# EAGLE design NinjaPCR-131202 (EAGLE 6.3)
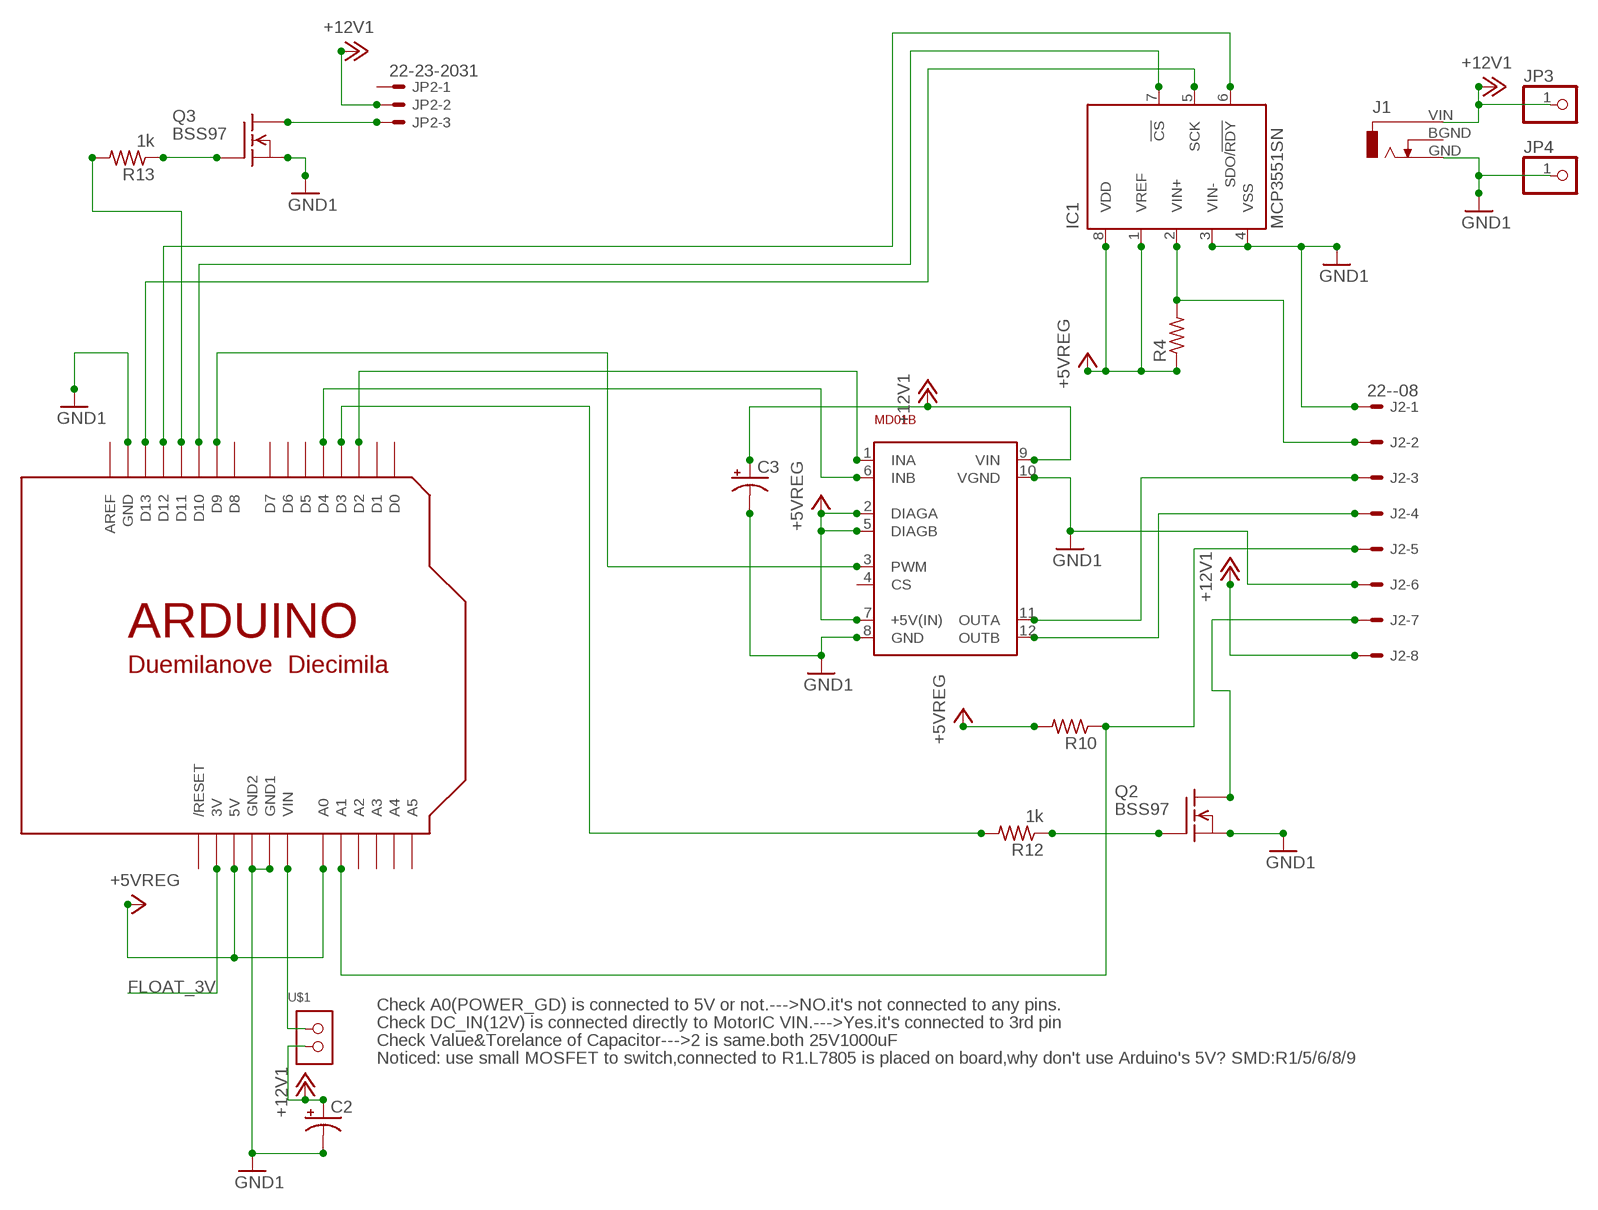
[diagram p0: schematic, sheet 1]

## Parts
C2  CPOL-USE5-8.5  [E5-8,5]
C3  CPOL-USE5-13  [E5-13]
IC1  MCP3551SN  [SO-08]
J1  DCJ0303  [DCJ0303]
J2  22--08  [POLOLU-8-VERTICAL]
JP2  22-23-2031  [22-23-2031]
JP3  PINHD-1X1  [1X01]
JP4  PINHD-1X1  [1X01]
MD01B  VNH3SP30+4PINN  [VNH3SP30+4PIN_NOHOLES]
Q2  BSS97  [TO202]
Q3  BSS97  [TO202]
R4  R-US_0207/10  [0207/10]
R10  R-US_0207/10  [0207/10]
R12  1k  R-US_0207/10  [0207/10]
R13  1k  R-US_0207/10  [0207/10]
U$1  1X02  [1X02_1.1_UNSIGNED]
U$3  ARDUINODUEMILANOVE  [ARDUINO]

## Nets
+5VREG [2A]: IC1.1(VREF) IC1.8(VDD) MD01B.2(DIAGA) MD01B.5(DIAGB) MD01B.7(+5V(IN)) R4.1 R10.2 U$3.5V U$3.A0
+12V1 [8A]: C2.+ C3.+ J1.VIN J2.8 JP2.2 JP3.1 MD01B.9(VIN) U$1.2
D13: IC1.5(SCK) U$3.D13
FLOAT_3V: U$3.3V
GND1 [2A]: C2.- C3.- IC1.3(VIN-) IC1.4(VSS) J1.GND J2.1 J2.6 JP4.1 MD01B.8(GND) MD01B.10(VGND) Q2.1(S) Q3.1(S) U$3.GND U$3.GND1 U$3.GND2
N$1: JP2.3 Q3.2(D)
N$2: Q3.3(G) R13.1
N$3: R13.2 U$3.D11
N$5: U$1.1 U$3.VIN
N$8: R12.2 U$3.D3
N$9: J2.3 MD01B.11(OUTA)
N$10: J2.4 MD01B.12(OUTB)
N$18 [3A]: J2.7 Q2.2(D)
N$23: IC1.2(VIN+) J2.2 R4.2
N$27: IC1.6(SDO/!RDY) U$3.D12
N$29: IC1.7(!CS) U$3.D10
N$37: J2.5 R10.1 U$3.A1
S$1: MD01B.1(INA) U$3.D2
S$2: MD01B.3(PWM) U$3.D9
S$3: MD01B.6(INB) U$3.D4
T1: Q2.3(G) R12.1
Unconnected: J1.BGND JP2.1 MD01B.4(CS) U$3.A2 U$3.A3 U$3.A4 U$3.A5 U$3.AREF U$3.D0 U$3.D1 U$3.D5 U$3.D6 U$3.D7 U$3.D8 U$3.RESET(/RESET)

## Notes on the sheet
- Check A0(POWER_GD) is connected to 5V or not.--->NO.it's not connected to any pins.
- Check DC_IN(12V) is connected directly to MotorIC VIN.--->Yes.it's connected to 3rd pin
- Check Value&Torelance of Capacitor--->2 is same.both 25V1000uF
- Noticed: use small MOSFET to switch,connected to R1.L7805 is placed on board,why don't use Arduino's 5V? SMD:R1/5/6/8/9

## Library data of the parts
C2 C3 = rcl:CPOL-US: POLARIZED CAPACITOR, American symbol
IC1 = microchip:MCP355*: Low-Power, Single-Channel 22-Bit Delta-Sigma ADCs Source: http://ww1.microchip.com/downloads/en/DeviceDoc/21950c.pdf; MPN: MCP3551-E/SN; OC_FARNELL: 1084625; OC_NEWARK: 97K4494
J1 = JACK:DCJ0303: DC POWER JACK Source: DCJ0303.pdf; OC_FARNELL: unknown; OC_NEWARK: unknown
J2 = con-molex:22-?-08: CONNECTOR wire to board 2.54 mm (.1 inch) pitch header
JP2 = con-molex:22-23-2031: .100" (2.54mm) Center Header - 3 Pin; MF: MOLEX; MPN: 22-23-2031; OC_FARNELL: 1462950; OC_NEWARK: 30C0862
JP3 JP4 = pinhead:PINHD-1X1: PIN HEADER
MD01B = MOTORDRIVE:VNH3SP30+4PIN
Q2 Q3 = openpcr:BSS97: N-Channel Enhancement MOSFET 200V; 1.5A; 1,6Ohm
R4 R10 R12 R13 = resistor:R-US_: RESISTOR, American symbol
U$1 = PIN:1X02
U$3 = openpcr:ARDUINO: Arduino Diecimila/Duemilanove Make a shield with ease, this package has all the named pins as well as the two mounting drill holes and an outline of the USB and DC power connector. The outline is on the DIMENSION layer, so if your board house uses it they will cut the outline to match. http://www.ladyada.net/library/pcb/eaglelibrary.html

## Net classes
0 default: width 0.381 mm
1 2A: width 0.406 mm
2 8A: width 2.54 mm
3 3A: width 1.016 mm

## Board
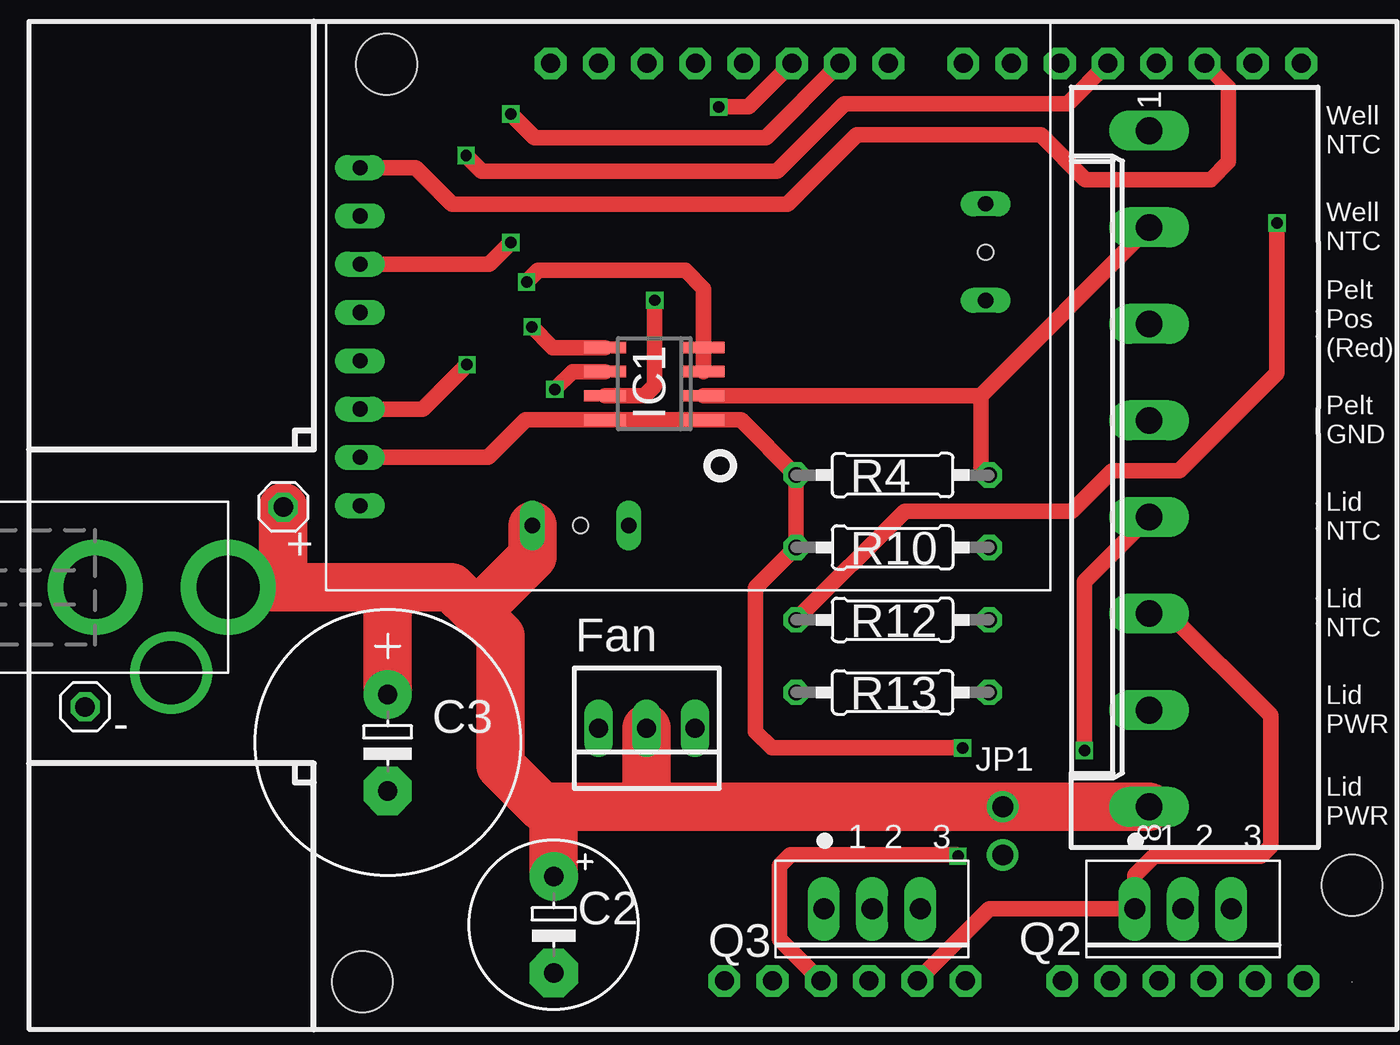
[diagram p1: board, top side]
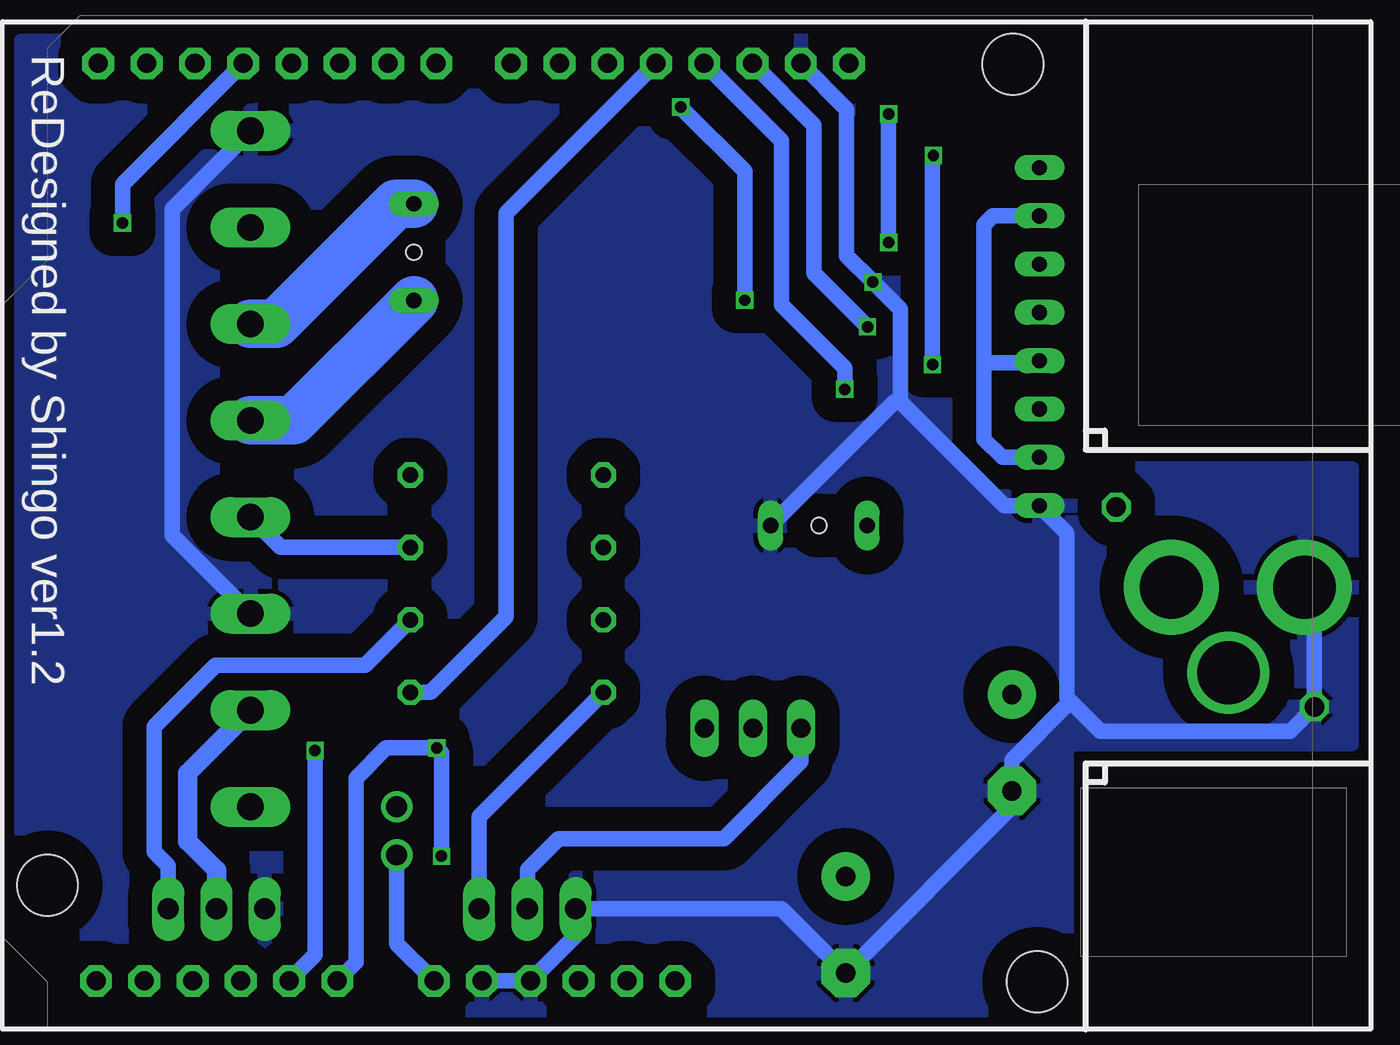
[diagram p2: board, bottom side, seen from below]

No outline drawn. Coordinates in mm, seen from the top.
Copper layers (1*16): Top 0.035mm / dielectric 1.5mm / Bottom 0.035mm
Design rules "Fusion_eagle_rule_v1.1": minimum track width 6mil, minimum drill 12mil, track to track 6mil, track to pad 6mil, pad to pad 6mil, via to via 6mil, smd to smd 0mil, copper to edge 10mil, drill to drill 10mil, minimum pad ring 10mil, minimum via ring 6mil, stop-mask expansion 2mil, vias tented up to drill 100mil, thermal gap 10mil

### Footprints (pad centres in the part's own frame; a part is rotated, then mirrored left to right if it is on the bottom)
E5-8,5 = drill 1.016 pad 2.54: + -2.54,0 | drill 1.016 pad 2.54 octagon: - 2.54,0
E5-13 = drill 1.016 pad 2.54: + -2.54,0 | drill 1.016 pad 2.54 octagon: - 2.54,0
SO-08 = smd 0.6 x 2.2: 1 -1.905,-2.6; 2 -0.635,-2.6; 3 0.635,-2.6; 4 1.905,-2.6; 5 1.905,2.6; 6 0.635,2.6; 7 -0.635,2.6; 8 -1.905,2.6
DCJ0303 = drill 3.3 pad 4: BGND 4.5,-3 | drill 3.3 pad 5: GND 0,-7; VIN 0,0
POLOLU-8-VERTICAL = drill 1.4 long: 1 17.78,0; 2 12.7,0; 3 7.62,0; 4 2.54,0; 5 -2.54,0; 6 -7.62,0; 7 -12.7,0; 8 -17.78,0
22-23-2031 = drill 1 long: 1 -2.54,0; 2 0,0; 3 2.54,0
1X01 = drill 1.016 octagon: 1 0,0
VNH3SP30+4PIN_NOHOLES = drill 0.8 long: 1 1.778,22.225; 2 1.778,19.685; 3 1.778,17.145; 4 1.778,14.605; 5 1.778,12.065; 6 1.778,9.525; 7 1.778,6.985; 8 1.778,4.445; 9 10.846,3.4; 10 15.926,3.4; 11 34.7,20.32; 12 34.7,15.24 | hole 0.8: 34.7,17.78; 13.386,3.4
TO202 = drill 1.118 long: 1 -2.54,-5.08; 2 0,-5.08; 3 2.54,-5.08
0207/10 = drill 0.813 octagon: 1 -5.08,0; 2 5.08,0
1X02_1.1_UNSIGNED = drill 1.1: 1 -2.54,0; 2 0,0
ARDUINO-NOSILK = drill 1 pad 1.676 octagon: 3V 36.068,2.54; 5V 38.608,2.54; A0 51.308,2.54; A1 53.848,2.54; A2 56.388,2.54; A3 58.928,2.54; A4 61.468,2.54; A5 64.008,2.54; AREF 24.384,50.8; D0 63.881,50.8; D1 61.341,50.8; D2 58.801,50.8; D3 56.261,50.8; D4 53.721,50.8; D5 51.181,50.8; D6 48.641,50.8; D7 46.101,50.8; D8 42.164,50.8; D9 39.624,50.8; D10 37.084,50.8; D11 34.544,50.8; D12 32.004,50.8; D13 29.464,50.8; GND 26.924,50.8; GND1 43.688,2.54; GND2 41.148,2.54; RESET 33.528,2.54; VIN 46.228,2.54 | hole 3.2: 15.758,50.754; 66.558,7.574; 14.488,2.494

### Placement (x,y rotation side)
C2  27.62,5.5 270 top
C3  18.88,15.07 270 top
IC1  32.92,33.95 90 top
J1  10.49,23.25 270 top
J2  58.95,29.48 90 top
JP2  32.52,15.83 180 top
JP3  13.4,27.46 270 top
JP4  2.96,16.95 270 top
MD01B  15.65,23.1 0 top
Q2  60.74,11.41 0 top
Q3  44.38,11.41 0 top
R4  45.45,29.15 0 top
R10  45.45,25.34 180 top
R12  45.45,21.53 180 top
R13  45.45,17.72 0 top
U$1  51.25,11.7 90 top
U$3  ARDUINODUEMILANOVE  [ARDUINO-NOSILK]  3.07,0 0 top

### Tracks (layer width: path | path; a pad name or v marks a point on that pad's centre or on a via)
+5VREG  (via drill 0.6)
  Top 0.813: v48.9,9.11 48.84,9.17 40.07,9.17 39.5,8.59 39.5,4.72 U$3.5V | v49.14,14.79 39.11,14.79 38.25,15.65 38.25,23.22 R10.2 R4.1 37.48,32.05 IC1.1 IC1.8 26.15,32.05 24.18,30.08 MD01B.7
  Bottom 0.813: U$3.A0 53.39,3.53 53.39,13.21 51.81,14.79 v49.14,14.79 48.9,14.55 v48.9,9.11 | MD01B.2 19.88,42.78 20.36,42.31 20.36,35.04 | 20.36,35.04 20.36,31.05 19.39,30.08 MD01B.7 | MD01B.5 17.55,35.04 20.36,35.04
+12V1
  Top 2.54: J1.VIN 13.01,23.25 | JP3.1 13.4,23.63 13.01,23.25 | 27.62,11.7 26.97,11.7 24.82,13.86 24.82,20.66 23.55,21.92 | 27.62,11.7 32.52,11.7 | 32.52,11.7 U$1.2 52.27,11.7 J2.8 | 23.55,21.92 22.23,23.25 18.89,23.25 | 18.89,23.25 13.01,23.25 | C2.+ 27.62,11.7 | JP2.2 32.52,11.7 | MD01B.9 26.5,24.87 23.55,21.92 | C3.+ 18.89,23.25
D13  (via drill 0.6)
  Top 0.813: IC1.5 27.57,35.86 v26.48,36.95
  Bottom 0.813: v26.48,36.95 29.3,39.77 29.3,47.56 U$3.D13
GND1  (via drill 0.6)
  Top 0.813: U$3.GND1 50.55,6.33 Q2.1 58.2,8.1 59.2,9.11 64.84,9.11 65.35,9.62 65.35,16.51 60,21.86 J2.6 | IC1.3 IC1.4 35.52,38.95 34.55,39.92 26.81,39.92 v26.2,39.31
  Bottom 0.813: J1.GND 2.96,22.72 JP4.1 4.24,15.67 14.23,15.67 15.8,17.25 | 15.8,17.25 15.98,17.43 15.98,26.09 MD01B.8 19.29,27.54 24.75,33.01 | C3.- 18.89,14.16 15.8,17.25 | 18.89,12.69 C3.- | U$3.GND1 U$3.GND2 41.84,4.92 Q3.1 31,6.33 C2.- 18.89,11.69 C3.- | U$3.GND 27.59,48.39 27.59,40.69 v26.2,39.31 24.75,37.86 24.75,33.01 | MD01B.10 25.06,33.01 24.75,33.01 | J2.1 63.08,43.13 63.08,25.99 J2.6 | 19.05,12.53 C3.-
  pour Bottom (isolate 1.27): 16,52 71,52 71,1 16,1 16,15 1,15 1,29.5 16,29.5
N$1
  Bottom 0.813: Q3.2 44.38,8.39 42.75,10.03 34.04,10.03 29.98,14.09 JP2.3
N$2
  Bottom 0.813: R13.1 46.92,11.18 Q3.3
N$3
  Bottom 0.813: R13.2 49.46,17.72 45.49,21.69 45.49,42.92 U$3.D11
N$5
  Bottom 0.813: U$3.VIN 51.25,4.49 U$1.1
N$8  (via drill 0.6)
  Top 0.813: R12.2 46.09,27.25 54.88,27.25 57.01,29.38 60.55,29.38 65.68,34.51 v65.68,42.41
  Bottom 0.813: v65.68,42.41 65.68,44.45 U$3.D3
N$9
  Bottom 2.54: J2.3 57.59,37.1 51.28,43.41 MD01B.11
N$10
  Bottom 2.54: J2.4 56.67,32.02 MD01B.12
N$18
  Bottom 1.016: Q2.2 60.74,8.37 62.26,9.89 62.26,13.47 J2.7
N$23
  Top 0.813: 50.09,33.32 IC1.2 | J2.2 50.09,33.32 | R4.2 50.09,29.6 50.09,33.32
N$27  (via drill 0.6)
  Top 0.813: v27.68,33.66 28.61,34.59 IC1.6
  Bottom 0.813: U$3.D12 31.01,46.73 31.01,38.11 27.68,34.78 v27.68,33.66
N$29  (via drill 0.6)
  Top 0.813: v32.94,38.35 32.94,33.84 32.41,33.31 32.4,33.32 IC1.7 | v36.31,48.51 37.87,48.51 U$3.D10
  Bottom 0.813: v32.94,38.35 32.94,45.13 v36.31,48.5 v36.31,48.51
N$37  (via drill 0.6)
  Top 0.813: v55.55,14.66 55.55,23.54 J2.5
  Bottom 0.813: R10.1 57.35,25.34 J2.5 | U$3.A1 55.55,3.91 v55.55,14.66
S$1
  Top 0.813: U$3.D2 63.12,49.55 63.12,45.62 62.19,44.69 55.61,44.69 53.25,47.05 48.73,47.05 48.24,47.05 43.59,47.05 39.93,43.39 22.29,43.39 20.36,45.32 MD01B.1
S$2  (via drill 0.6)
  Top 0.813: U$3.D9 38.78,46.89 26.62,46.89 v25.37,48.14 | v25.37,41.39 24.22,40.24 MD01B.3
  Bottom 0.813: v25.37,41.39 v25.37,48.14
S$3  (via drill 0.6)
  Top 0.813: v23.06,34.96 20.72,32.62 MD01B.6 | U$3.D4 54.68,48.69 42.93,48.69 39.37,45.13 23.84,45.13 v23.01,45.96
  Bottom 0.813: v23.06,34.96 23.06,45.91 v23.01,45.96
T1
  Bottom 0.813: Q2.3 63.28,8.61 64.01,9.34 64.01,15.91 60.77,19.14 52.92,19.14 R12.1

### Text on the board
tPlace: Well / NTC | Well / NTC | Pelt / Pos / (Red) | IC1 | Pelt / GND | R4 | Lid / NTC | + | R10 | R12 | Lid / NTC | Fan | R13 | C3 | Lid / PWR | - | JP1 | Lid / PWR | C2 | Q3 | Q2
bPlace: ReDesigned by Shingo ver1.2